# Altium schematic sheet shcematics.SchDoc: Ultra-Precision low speed ramp generator for low current calibration
size A2; PageSetup: Record=PageOptions|CenterHorizontal=True|CenterVertical=True|PrintScale=0.52|XCorrection=1.00|YCorrection=1.00|PrintKind=0|BorderSize=5000000|LeftOffset=0|BottomOffset=0|Orientation=2|PaperLength=1000|PaperWidth=1000|Scale=100|PaperSource=7|PrintQuality=-3|MediaType=1|DitherType=10|PrintScaleMode=1|PaperKind=A4|PaperIndex=9
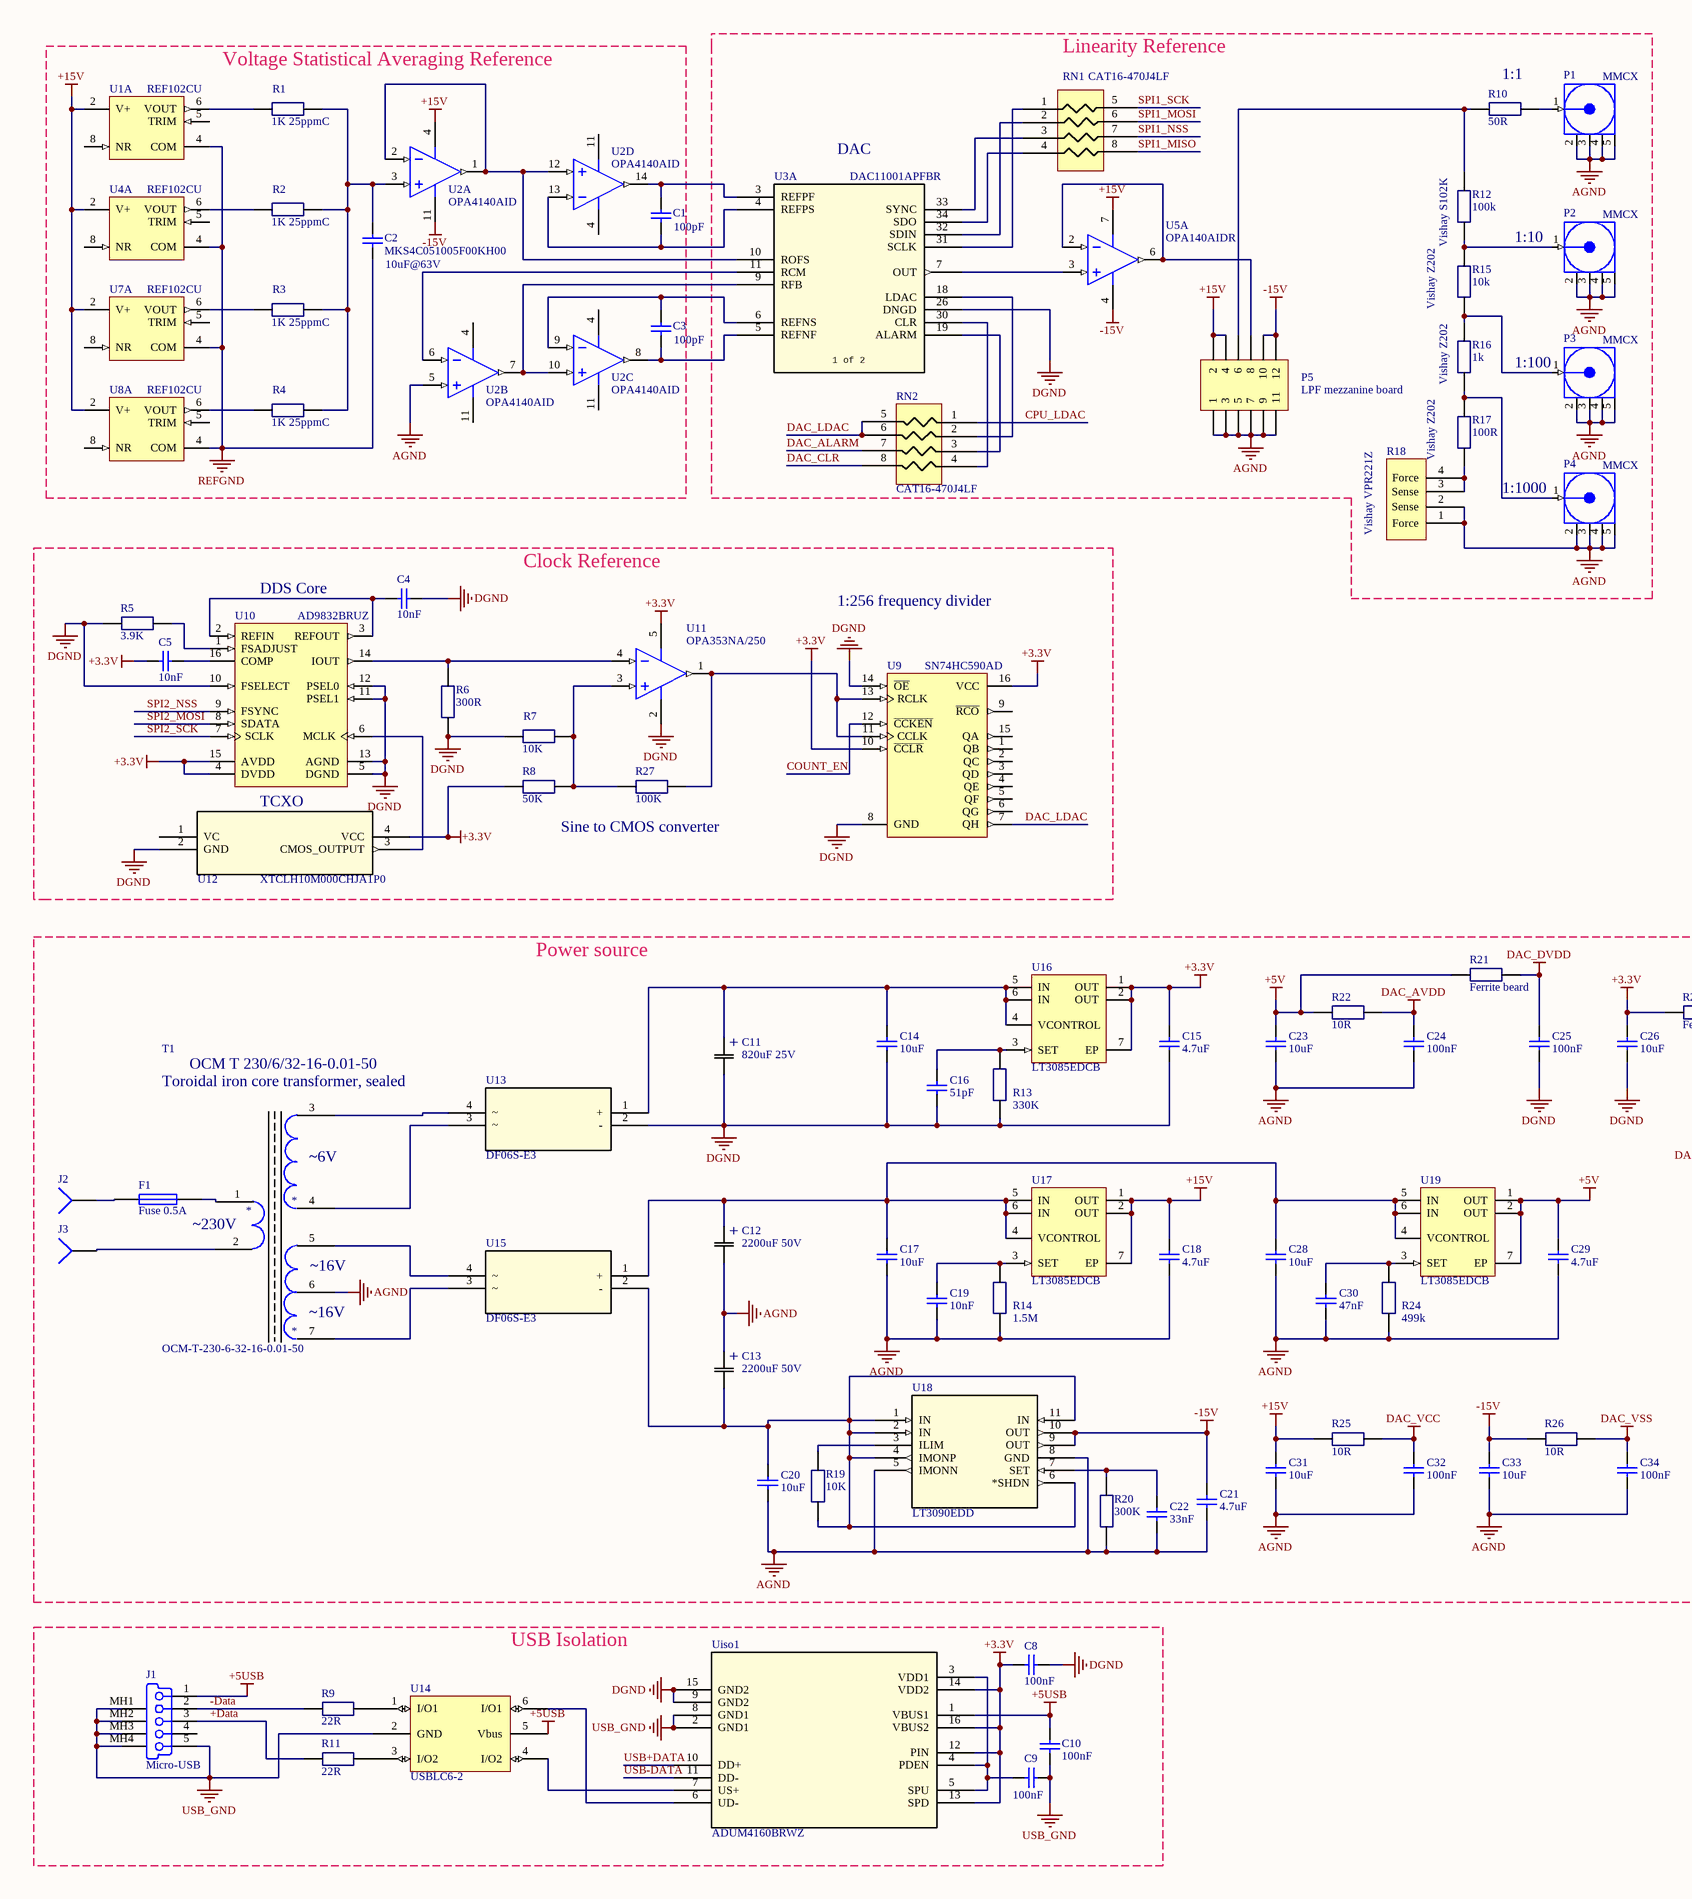
[diagram p0: shcematics.SchDoc, left]
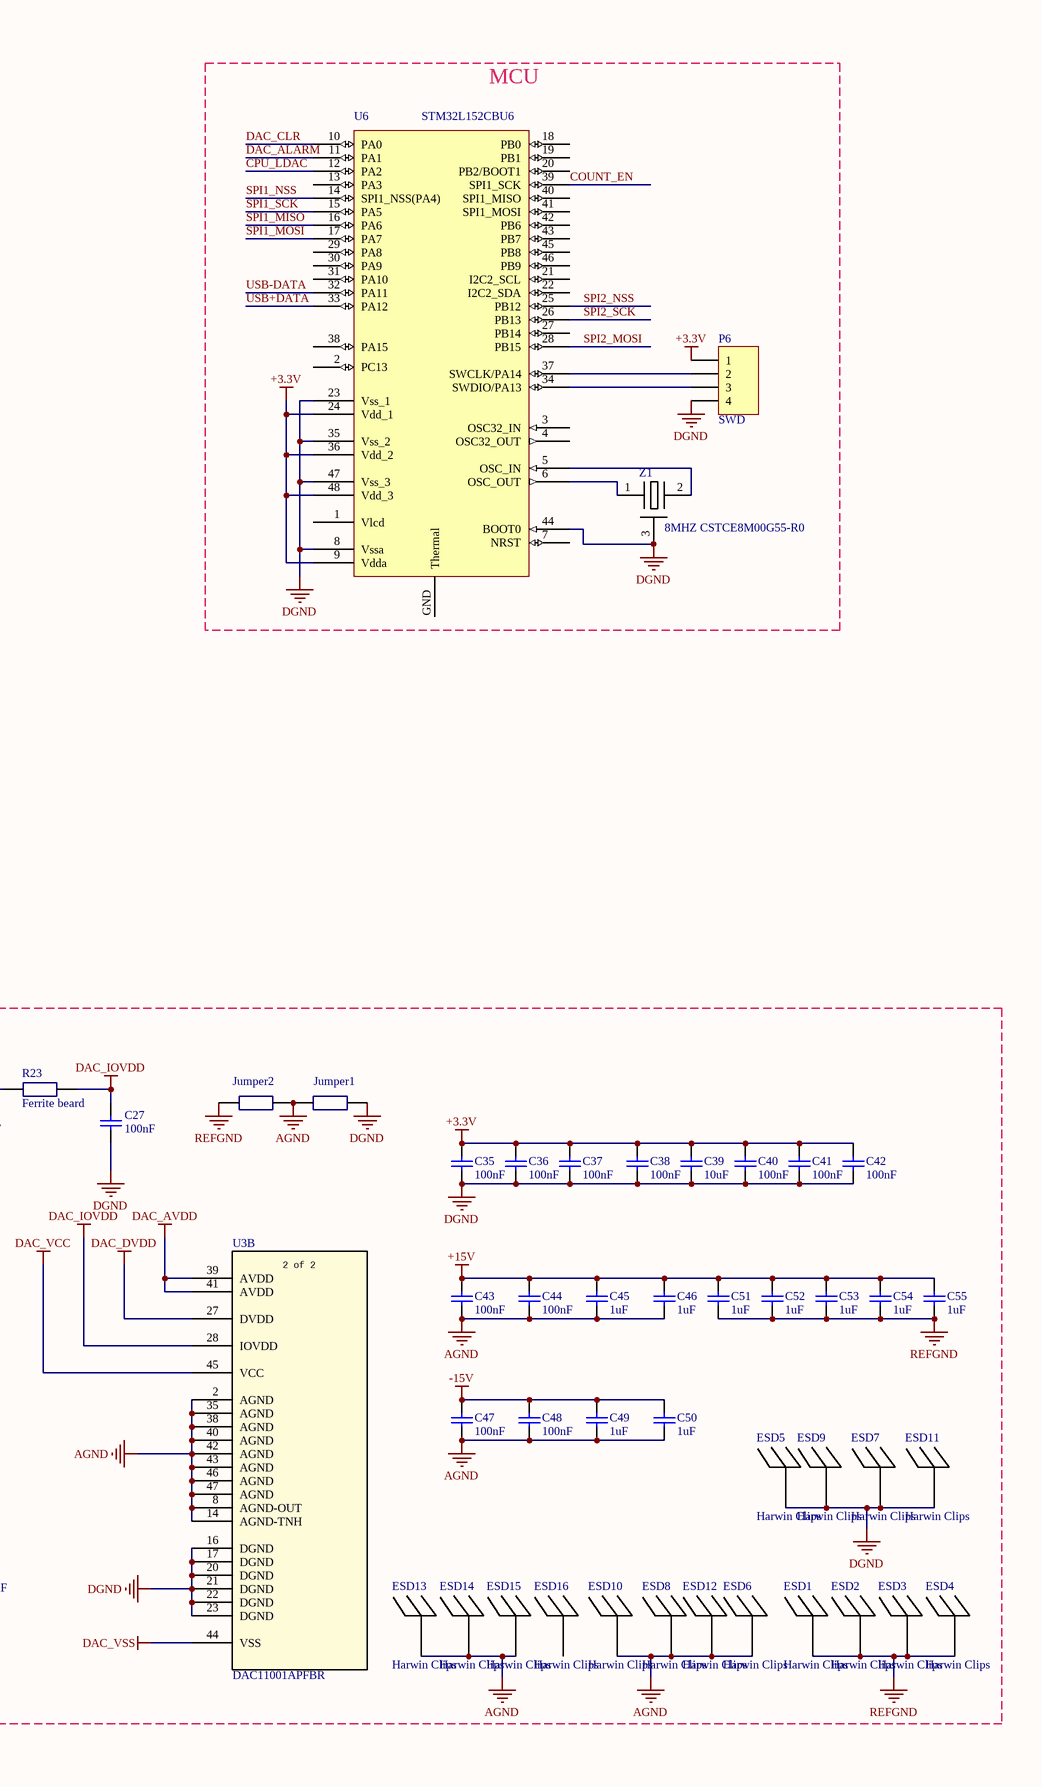
[diagram p1: shcematics.SchDoc, right]

## Parts
C1  value 100pF  [0402]  (hidden comment: Cap Semi)
C2  MKS4C051005F00KH00  value 10uF@63V  [MKS4C051005F]
C3  value 100pF  [0402]  (hidden comment: Cap Semi)
C4  10nF  [CAP 0603]
C5  10nF  [CAP 0603]
C8  100nF  [CAP 0603]
C9  100nF  [CAP 0603]
C10  100nF  [CAP 0603]
C11  820uF 25V  [CAP_37M000_TDK]
C12  2200uF 50V  [CAP_37M000_TDK]
C13  2200uF 50V  [CAP_37M000_TDK]
C14  10uF  [C1206]
C15  4.7uF  [C1206]
C16  51pF  [CAP 0603]
C17  10uF  [C1206]
C18  4.7uF  [C1206]
C19  10nF  [CAP 0603]
C20  10uF  [C1206]
C21  4.7uF  [C1206]
C22  33nF  [CAP 0603]
C23  10uF  [CAP 0603]
C24  100nF  [CAP 0603]
C25  100nF  [CAP 0603]
C26  10uF  [CAP 0603]
C27  100nF  [CAP 0603]
C28  10uF  [C1206]
C29  4.7uF  [C1206]
C30  47nF  [CAP 0603]
C31  10uF  [C1206]
C32  100nF  [CAP 0603]
C33  10uF  [C1206]
C34  100nF  [CAP 0603]
C35  100nF  [CAP 0603]
C36  100nF  [CAP 0603]
C37  100nF  [CAP 0603]
C38  100nF  [CAP 0603]
C39  10uF  [CAP 0603]
C40  100nF  [CAP 0603]
C41  100nF  [CAP 0603]
C42  100nF  [CAP 0603]
C43  100nF  [CAP 0603]
C44  100nF  [CAP 0603]
C45  1uF  [CAP 0603]
C46  1uF  [CAP 0603]
C47  100nF  [CAP 0603]
C48  100nF  [CAP 0603]
C49  1uF  [CAP 0603]
C50  1uF  [CAP 0603]
C51  1uF  [CAP 0603]
C52  1uF  [CAP 0603]
C53  1uF  [CAP 0603]
C54  1uF  [CAP 0603]
C55  1uF  [CAP 0603]
ESD1  Harwin Clips  [HARWIN - S0981-46R - CLIP]
ESD2  Harwin Clips  [HARWIN - S0981-46R - CLIP]
ESD3  Harwin Clips  [HARWIN - S0981-46R - CLIP]
ESD4  Harwin Clips  [HARWIN - S0981-46R - CLIP]
ESD5  Harwin Clips  [HARWIN - S0981-46R - CLIP]
ESD6  Harwin Clips  [HARWIN - S0981-46R - CLIP]
ESD7  Harwin Clips  [HARWIN - S0981-46R - CLIP]
ESD8  Harwin Clips  [HARWIN - S0981-46R - CLIP]
ESD9  Harwin Clips  [HARWIN - S0981-46R - CLIP]
ESD10  Harwin Clips  [HARWIN - S0981-46R - CLIP]
ESD11  Harwin Clips  [HARWIN - S0981-46R - CLIP]
ESD12  Harwin Clips  [HARWIN - S0981-46R - CLIP]
ESD13  Harwin Clips  [HARWIN - S0981-46R - CLIP]
ESD14  Harwin Clips  [HARWIN - S0981-46R - CLIP]
ESD15  Harwin Clips  [HARWIN - S0981-46R - CLIP]
ESD16  Harwin Clips  [HARWIN - S0981-46R - CLIP]
F1  Fuse 0.5A  [FUSE]
J1  Micro-USB  [10118193-0001LF]
J2  Socket  [PIN1]  (value not drawn)
J3  Socket  [PIN1]  (value not drawn)
Jumper1  (no value)  [0402 jumper]  (net tie, no BOM)
Jumper2  (no value)  [0402 jumper]  (net tie, no BOM)
P1  MMCX  [MMCX2.54-V5]
P2  MMCX  [MMCX2.54-V5]
P3  MMCX  [MMCX2.54-V5]
P4  MMCX  [MMCX2.54-V5]
P5  LPF mezzanine board  [HDR2X6]
P6  SWD  [HDR1X4]
R1  1K 25ppmC  [1608[0603]]
R2  1K 25ppmC  [1608[0603]]
R3  1K 25ppmC  [1608[0603]]
R4  1K 25ppmC  [1608[0603]]
R5  3.9K  [1608[0603]]
R6  300R  [Yegeo 0603]
R7  10K  [Yegeo 0603]
R8  50K  [Yegeo 0603]
R9  22R  [1608[0603]]
R10  50R  [1608[0603]]
R11  22R  [1608[0603]]
R12  100k  [Vishay S102K]
R13  330K  [1608[0603]]
R14  1.5M  [6-0805_M]
R15  10k  [Vishay Z202]
R16  1k  [Vishay Z202]
R17  100R  [Vishay Z202]
R18  Vishay VPR221Z  [VISHAY VPR221Z]
R19  10K  [1608[0603]]
R20  300K  [1608[0603]]
R21  Ferrite beard  [CC1206JRNPOBBN100]
R22  10R  [1608[0603]]
R23  Ferrite beard  [CC1206JRNPOBBN100]
R24  499k  [1608[0603]]
R25  10R  [1608[0603]]
R26  10R  [1608[0603]]
R27  100K  [Yegeo 0603]
RN1  CAT16-470J4LF  [CAT16-470J4LF]
RN2  CAT16-470J4LF  [CAT16-470J4LF]
T1  OCM-T-230-6-32-16-0.01-50  [OCM-T-230-6-32-16-0.01-50]
U1  REF102CU  [TI-D8_N]  (part A of 2)
U2  OPA4140AID  [TI-D14_N]  (parts A,B,C,D of 4)
U3  DAC11001APFBR  [QFP_APFBR_TEX]  (parts A,B of 2)
U4  REF102CU  [TI-D8_N]  (part A of 2)
U5  OPA140AIDR  [TI-D8_N]  (part A of 2)
U6  STM32L152CBU6  [UFQFPN48]
U7  REF102CU  [TI-D8_N]  (part A of 2)
U8  REF102CU  [TI-D8_N]  (part A of 2)
U9  SN74HC590AD  [D016_N]
U10  AD9832BRUZ  [ADI-RU-16_N]
U11  OPA353NA/250  [TI-DBV5_N]
U12  XTCLH10M000CHJA1P0  [XTCLH20M000CHJA0P0_MUR]
U13  DF06S-E3  [SO4_DFS_VIS-M]
U14  USBLC6-2  [SOT23-6L]
U15  DF06S-E3  [SO4_DFS_VIS-M]
U16  LT3085EDCB  [LT-DCB-6_V]
U17  LT3085EDCB  [LT-DCB-6_V]
U18  LT3090EDD  [DFN-10_DD]
U19  LT3085EDCB  [LT-DCB-6_V]
Uiso1  ADUM4160BRWZ  [RW_16_ADI]
Z1  8MHZ CSTCE8M00G55-R0  [PRQV8.00CR5010Y000]

## Blocks framed on the sheet
Voltage Statistical Averaging Reference: C1-C3 R1-R4 U1 U2 U4 U7 U8
Linearity Reference: P1-P5 R10 R12 R15-R18 RN1 RN2 U3 U5
MCU: P6 U6 Z1
Clock Reference: C4 C5 R5-R8 R27 U9-U12
Power source: C11-C55 ESD1-ESD16 F1 J2 J3 Jumper1 Jumper2 R13 R14 R19-R26 T1 U3 U13 U15-U19
USB Isolation: C8-C10 J1 R9 R11 U14 Uiso1

## Nets
+3.3V: C5.1 C8.2 C15.1 C26.1 C35.2 C36.2 C37.2 C38.2 C39.2 C40.2 C41.2 C42.2 P6.1 R8.2 R23.2 U6.9(Vdda) U6.24(Vdd_1) U6.36(Vdd_2) U6.48(Vdd_3) U9.10(~{CCLR}) U9.16(VCC) U10.4(DVDD) U10.15(AVDD) U11.5(V+) U12.4(VCC) U16.1(OUT) U16.2(OUT) U16.7(EP) Uiso1.12(PIN) Uiso1.13(SPD) Uiso1.14(VDD2) Uiso1.16(VBUS2)
+5USB: C10.2 J1.1(V_BUS_(5V)) U14.5(Vbus) Uiso1.1(VBUS1)
+5V: C23.1 C29.1 R21.2 R22.2 U19.1(OUT) U19.2(OUT) U19.7(EP)
+15V: C18.1 C31.1 C43.2 C44.2 C45.2 C46.2 C51.2 C52.2 C53.2 C54.2 C55.2 P5.2 P5.4 R25.2 U1.2(V+) U2.4(V+) U4.2(V+) U5.7(V+) U7.2(V+) U8.2(V+) U17.1(OUT) U17.2(OUT) U17.7(EP)
-15V: C21.1 C33.1 C47.2 C48.2 C49.2 C50.2 P5.10 P5.12 R26.2 U2.11(V-) U5.4(V-) U18.9(OUT) U18.10(OUT)
AGND: C12.2 C13.1 C17.2 C18.2 C19.2 C20.2 C21.2 C22.2 C23.2 C24.2 C28.2 C29.2 C30.2 C31.2 C32.2 C33.2 C34.2 C43.1 C44.1 C45.1 C46.1 C47.1 C48.1 C49.1 C50.1 ESD6.1 ESD8.1 ESD10.1 ESD12.1 ESD13.1 ESD14.1 ESD15.1 Jumper1.2 Jumper2.2 P1.2(GND) P1.3(GND) P1.4(GND) P1.5(GND) P2.2(GND) P2.3(GND) P2.4(GND) P2.5(GND) P3.2(GND) P3.3(GND) P3.4(GND) P3.5(GND) P4.2(GND) P4.3(GND) P4.4(GND) P4.5(GND) P5.1 P5.3 P5.5 P5.7 P5.9 P5.11 R14.2 R18.1(Force) R18.2(Sense) R20.1(A) R24.2 T1.6 U2.5(IN_B+) U3.2(AGND) U3.8(AGND-OUT) U3.14(AGND-TNH) U3.35(AGND) U3.38(AGND) U3.40(AGND) U3.42(AGND) U3.43(AGND) U3.46(AGND) U3.47(AGND) U18.5(IMONN) U18.8(GND)
DAC_AVDD: C24.1 R22.1(A) U3.39(AVDD) U3.41(AVDD)
DAC_DVDD: C25.1 R21.1(A) U3.27(DVDD)
DAC_IOVDD: C27.1 R23.1(A) U3.28(IOVDD)
DAC_VCC: C32.1 R25.1(A) U3.45(VCC)
DAC_VSS: C34.1 R26.1(A) U3.44(VSS)
DGND: C4.2 C8.1 C11.2 C14.2 C15.2 C16.2 C25.2 C26.2 C27.2 C35.1 C36.1 C37.1 C38.1 C39.1 C40.1 C41.1 C42.1 ESD5.1 ESD7.1 ESD9.1 ESD11.1 Jumper1.1(A) P6.4 R5.2 R6.1(A) R7.2 R13.2 U3.16(DGND) U3.17(DGND) U3.20(DGND) U3.21(DGND) U3.22(DGND) U3.23(DGND) U3.26(DNGD) U6.8(Vssa) U6.23(Vss_1) U6.35(Vss_2) U6.44(BOOT0) U6.47(Vss_3) U9.8(GND) U9.14(~{OE}) U10.5(DGND) U10.10(FSELECT) U10.11(PSEL1) U10.12(PSEL0) U10.13(AGND) U11.2(V-) U12.2(GND) U13.2(-) Uiso1.9(GND2) Uiso1.15(GND2) Z1.3
REFGND: C2.1 C51.1 C52.1 C53.1 C54.1 C55.1 ESD1.1 ESD2.1 ESD3.1 ESD4.1 Jumper2.1(A) U1.4(COM) U4.4(COM) U7.4(COM) U8.4(COM)
USB_GND: C9.1 C10.1 J1.5(GND) J1.MH1(Tab) J1.MH2(Tab) J1.MH3(Tab) J1.MH4(Tab) U14.2(GND) Uiso1.2(GND1) Uiso1.8(GND1)
+Data: J1.3(D+) R11.2
-Data: J1.2(D-) R9.2
COUNT_EN: U6.39(SPI1_SCK) U9.12(~{CCKEN})
CPU_LDAC: RN2.1 U6.12(PA2)
DAC_ALARM: RN2.7 U6.11(PA1)
DAC_CLR: RN2.8 U6.10(PA0)
DAC_LDAC: RN2.5 RN2.6 U9.7(QH)
SPI1_MISO: RN1.8 U6.16(PA6)
SPI1_MOSI: RN1.6 U6.17(PA7)
SPI1_NSS: RN1.7 U6.14(SPI1_NSS(PA4))
SPI1_SCK: RN1.5 U6.15(PA5)
SPI2_MOSI: U6.28(PB15) U10.8(SDATA)
SPI2_NSS: U6.25(PB12) U10.9(FSYNC)
SPI2_SCK: U6.26(PB13) U10.7(SCLK)
USB+DATA: U6.33(PA12) Uiso1.10(DD+)
USB-DATA: U6.32(PA11) Uiso1.11(DD-)
NetC1_1: C1.1 U2.13(IN_D-) U3.4(REFPS)
NetC1_2: C1.2 U2.14(OUT_D) U3.3(REFPF)
NetC2_2: C2.2 R1.1(A) R2.1(A) R3.1(A) R4.1(A) U2.3(IN_A+)
NetC3_1: C3.1 U2.8(OUT_C) U3.5(REFNF)
NetC3_2: C3.2 U2.9(IN_C-) U3.6(REFNS)
NetC4_1: C4.1 U10.2(REFIN) U10.3(REFOUT)
NetC5_2: C5.2 U10.16(COMP)
NetC9_2: C9.2 Uiso1.3(VDD1) Uiso1.4(PDEN) Uiso1.5(SPU)
NetC11_1: C11.1 C14.1 U13.1(+) U16.4(VCONTROL) U16.5(IN) U16.6(IN)
NetC12_1: C12.1 C17.1 C28.1 U15.1(+) U17.4(VCONTROL) U17.5(IN) U17.6(IN) U19.4(VCONTROL) U19.5(IN) U19.6(IN)
NetC13_2: C13.2 C20.1 R19.1(A) U15.2(-) U18.1(IN) U18.2(IN) U18.4(IMONP) U18.6(*SHDN) U18.11(IN)
NetC16_1: C16.1 R13.1(A) U16.3(SET)
NetC19_1: C19.1 R14.1(A) U17.3(SET)
NetC22_1: C22.1 R20.2 U18.7(SET)
NetC30_1: C30.1 R24.1(A) U19.3(SET)
NetF1_1: F1.1 J2.1
NetF1_2: F1.2 T1.1
NetJ3_1: J3.1 T1.2
NetP1_1: P1.1(Signal) R10.1(A)
NetP2_1: P2.1(Signal) R12.2 R15.1(A)
NetP3_1: P3.1(Signal) R15.2 R16.1(A)
NetP4_1: P4.1(Signal) R16.2 R17.1(A)
NetP5_6: P5.6 R10.2 R12.1(A)
NetP5_8: P5.8 U5.2(IN-) U5.6(OUT)
NetP6_2: P6.2 U6.37(SWCLK/PA14)
NetP6_3: P6.3 U6.34(SWDIO/PA13)
NetR1_2: R1.2 U1.6(VOUT)
NetR2_2: R2.2 U4.6(VOUT)
NetR3_2: R3.2 U7.6(VOUT)
NetR4_2: R4.2 U8.6(VOUT)
NetR5_1: R5.1(A) U10.1(FSADJUST)
NetR6_2: R6.2 U10.14(IOUT) U11.4(IN-)
NetR7_1: R7.1(A) R8.1(A) R27.2 U11.3(IN+)
NetR9_1: R9.1(A) U14.1(I/O1)
NetR11_1: R11.1(A) U14.3(I/O2)
NetR17_2: R17.2 R18.3(Sense) R18.4(Force)
NetR19_2: R19.2 U18.3(ILIM)
NetR27_1: R27.1(A) U9.11(CCLK) U9.13(RCLK) U11.1(OUT)
NetRN1_1: RN1.1 U3.31(SCLK)
NetRN1_2: RN1.2 U3.32(SDIN)
NetRN1_3: RN1.3 U3.33(SYNC)
NetRN1_4: RN1.4 U3.34(SDO)
NetRN2_2: RN2.2 U3.18(LDAC)
NetRN2_3: RN2.3 U3.19(ALARM)
NetRN2_4: RN2.4 U3.30(CLR)
NetT1_3: T1.3 U13.4
NetT1_4: T1.4 U13.3
NetT1_5: T1.5 U15.4
NetT1_7: T1.7 U15.3
NetU2_1: U2.1(OUT_A) U2.2(IN_A-) U2.12(IN_D+) U3.10(ROFS)
NetU2_6: U2.6(IN_B-) U3.11(RCM)
NetU2_7: U2.7(OUT_B) U2.10(IN_C+) U3.9(RFB)
NetU3_7: U3.7(OUT) U5.3(IN+)
NetU6_5: U6.5(OSC_IN) Z1.2
NetU6_6: U6.6(OSC_OUT) Z1.1
NetU10_6: U10.6(MCLK) U12.3(CMOS_OUTPUT)
NetU14_4: U14.4(I/O2) Uiso1.7(US+)
NetU14_6: U14.6(I/O1) Uiso1.6(UD-)

Not connected (* = marked no-connect by the designer): ESD16 1; J1 4(NC); U1 5(TRIM) 8(NR); U4 5(TRIM) 8(NR); U6 1(Vlcd) 2(PC13) 3(OSC32_IN) 4(OSC32_OUT) 7(NRST) 13(PA3) 18(PB0) 19(PB1) 20(PB2/BOOT1) 21(I2C2_SCL) 22(I2C2_SDA) 27(PB14) 29(PA8) 30(PA9) 31(PA10) 38(PA15) 40(SPI1_MISO) 41(SPI1_MOSI) 42(PB6) 43(PB7) 45(PB8) 46(PB9) GND(Thermal); U7 5(TRIM) 8(NR); U8 5(TRIM) 8(NR); U9 1(QB) 2(QC) 3(QD) 4(QE) 5(QF) 6(QG) 9(~{RCO}) 15(QA); U12 1(VC)

## Notes on the sheet
- (near R10) 1:1
- (near U3) DAC
- (near P2) 1:10
- (near P3) 1:100
- (near P4) 1:1000
- (near U10) DDS Core
- 1:256 frequency divider
- TCXO
- Sine to CMOS converter
- (in symbol B41858D9337M000) +
- (in symbol DAC11001APFBR, part A) 1 of 2
- (in symbol DAC11001APFBR, part B) 2 of 2
- (in symbol OCM-T-230-6-32-16-0.01-50) OCM T 230/6/32-16-0.01-50; Toroidal iron core transformer, sealed; ~6V; ~230V; ~16V

## Library data of the parts
C1 C3 = Cap Semi: Capacitor (Semiconductor SIM Model); Published: 8-Jun-2000; LatestRevisionDate: 29-May-2009; LatestRevisionNote: IPC-7351 Footprint Added.; PackageReference: C1206; Publisher: Altium Limited; PackageDescription: Chip Capacitor
C2 = Cap: Capacitor; Published: 8-Jun-2000; LatestRevisionDate: 17-Jul-2002; LatestRevisionNote: Re-released for DXP Platform.; PackageReference: RAD-0.3; Publisher: Altium Limited; PackageDescription: Radial Cap, Thru-Hole; 2 Leads; 0.3 in Pin Spacing; Oredr: MKS4C051005F00KH00
C4 C5 C8-C10 C16 C19 C22-C27 C30-C55 = Cap Semi: Capacitor (Semiconductor SIM Model); Order: CC0603KRX7R8BB104; Published: 8-Jun-2000; LatestRevisionDate: 29-May-2009; LatestRevisionNote: IPC-7351 Footprint Added.; PackageReference: C1206; Publisher: Altium Limited; PackageDescription: Chip Capacitor
  C4 C5 C19: Value: 10nF
  C8-C10 C24 C25 C27 C32 C34-C38 C40-C44 C47 C48: Value: 100nF
  C16: Value: 51pF
  C22: Value: 33nF
  C23 C26 C31 C33 C39: Value: 10uF
  C30: Value: 47nF
  C45 C46 C49-C55: Value: 1uF
C11-C13 = B41858D9337M000: No Description Available; Vendor: TDK; Built_By: EMA_Matt; SourceLibrary: Add_to_database_2021-01-04; Type: DEV; Datasheet: https://product.tdk.com/info/en/documents/data_sheet/20/30/db/aec/B41858.pdf; Copyright: Copyright (C) 2018 Accelerated Designs. All rights reserved; Manufacturer_Part_Number: B41858D9337M000; RefDes: RefDes
C14 C17 C28 = Cap Semi: Capacitor (Semiconductor SIM Model); Order: GRM31CR61A476ME15L; Published: 8-Jun-2000; LatestRevisionDate: 29-May-2009; LatestRevisionNote: IPC-7351 Footprint Added.; PackageReference: C1206; Publisher: Altium Limited; PackageDescription: Chip Capacitor; Value: 10uF
C15 C18 C20 C21 C29 = Cap Semi: Capacitor (Semiconductor SIM Model); Order: GRM31CR71A475KA01L; Published: 8-Jun-2000; LatestRevisionDate: 29-May-2009; LatestRevisionNote: IPC-7351 Footprint Added.; PackageReference: C1206; Publisher: Altium Limited; PackageDescription: Chip Capacitor
  C15 C18 C21 C29: Value: 4.7uF
  C20: Value: 10uF
ESD1-ESD16 = Harwin Clips: Order: S0981-46R
F1 = Fuse 1: Fuse; Published: 8-Jun-2000; LatestRevisionDate: 17-Jul-2002; LatestRevisionNote: Re-released for DXP Platform.; PackageReference: PIN-W2/E2.8; Publisher: Altium Limited; PackageDescription: Thru-Hole; 2 Leads
J1 = 0481900001: USB On-The-Go (OTG) Mini-B Receptacle, Right Angle, SMT, 0.80mm (.031") Pitch, Solder Tabs with Back Cover, Recessed Type; Order: Molex 47346-0001
Jumper1 Jumper2 R12 R15-R17 = Resistor 0805: Avail: 20
  R12: Order: Vishay S102K; Value: 100k
  R15: Order: Vishay Z202; Value: 10k
  R16: Order: Vishay Z202; Value: 1k
  R17: Order: Vishay Z202; Value: 100R
P1-P4 = COAX-M: RF Coaxial PCB Connector, MMCX; Thru-Hole, Vertical Mount Plug,  50 Ohm Impedance; PackageDocument: Rev. A, 16-Jun-1997; PCB_Layout: Complies with manufacturer's recommendation.; DrillSize: Corresponds to nominal value.; Published: 15-Jul-2004; LatestRevisionDate: 15-Jul-2004; LatestRevisionNote: Component Replaced.; DatasheetDocument: 30-May-2003; PackageReference: 908-21103; Publisher: Altium Limited; ComponentLink1Description: Manufacturer Link; ComponentLink1URL: http://www.amphenolrf.com/
P5 = Header 6X2: Header, 6-Pin, Dual row; LatestRevisionDate: 17-Jul-2002; LatestRevisionNote: Re-released for DXP Platform.; Publisher: Altium Limited
P6 = Header 4: Header, 4-Pin; LatestRevisionDate: 17-Jul-2002; LatestRevisionNote: Re-released for DXP Platform.; Publisher: Altium Limited
R1-R8 R10 R27 = Resistor 0805: Order: ERA-3AEB49R9V; Avail: 20
  R1-R4: Value: 1K 25ppmC
  R5: Value: 3.9K
  R6: Value: 300R
  R7: Value: 10K
  R8: Value: 50K
  R10: Value: 50R
  R27: Value: 100K
R9 R11 = Resistor 0805: Order: CR0603-JW-220GLF; Avail: 20; Value: 22R
R13 R14 R24 = Resistor 0805: Order: ERA-3AEB2493V; Avail: 20
  R13: Value: 330K
  R14: Value: 1.5M
  R24: Value: 499k
R19 = Resistor 0805: Order: ERA-3AEB103V; Avail: 20; Value: 10K
R20-R23 R25 R26 = Resistor 0805: Order: ERA-3AEB4992V; Avail: 20
  R20: Value: 300K
  R21 R23: Value: Ferrite beard
  R22 R25 R26: Value: 10R
U1 U4 U7 U8 = REF102CU: 10 V Precision Voltage Reference, -25 to 85 degC, 8-pin SOIC (D), Green (RoHS & no Sb/Br); Manufacturer: Texas Instruments; Initial Accuracy @ 25/deg C(%): 0.05; Iout/Iz(Max)(mA): 10; Iq(Max)(uA): 1400; Rating: Catalog; SubFamily: Series Voltage Reference; Temp Coeff(Max)(ppm/ degree C): 5; VI(Max)(V): 36; VI(Min)(V): 11.4; DatasheetVersion: SBVS022B; PackageVersion: 4040047-3/M; PackageReference: D8; PackageDescription: 8-Pin Plastic Small Outline, Body 4.9 x 3.9 mm, Pitch 1.27 mm; Supplier 1: Digi-Key; Supplier Part Number 1: 296-17006-5-ND; Supplier 2: Newark; Supplier Part Number 2: 90H3365; Supplier 3: Mouser; Supplier Part Number 3: 595-REF102CU; Eco-Plan: Green (RoHS & no Sb/Br); VO(V): 10; Mounting Technology: Surface Mount; Code_JEDEC: MS-012; PartNumber: REF102CU; ComponentLink1Description: Manufacturer URL; ComponentLink1URL: http://www.ti.com/; ComponentLink2Description: Datasheet; ComponentLink2URL: http://www.ti.com/general/docs/lit/getliterature.tsp?genericPartNumber=REF102&fileType=pdf; ComponentLink3Description: Package Specification; ComponentLink3URL: http://www.ti.com/litv/pdf/msoi002j
U2 = OPA4140AID: 11 MHz, Single Supply, Low Noise, Precision, Rail-to-Rail Output, JFET Amplifier, 4.5 to 36 V, -40 to 125 degC, 14-pin SOIC (D14), Green (RoHS & no Sb/Br); Manufacturer: Texas Instruments; CMRR(Min)(dB): 126; GBW(Typ)(MHz): 11; IIB(Max)(pA): 10; Iq per channel(Max)(mA): 2; Number of Channels: 4; Offset Drift(Typ)(uV/C): 0.35; Packing: TUBE; Rating: Catalog; Slew Rate(Typ)(V/us): 20; Sub Family: High Supply Voltage Amplifier (>=30V), Low Input Bias Current Amp (<=10pA), Low Noise Amp (<=10nV/rtHz), Low Offset Voltage Amplifier (<=500uV), Precision Amplifier; Total Supply Voltage(Max)(+5V is 5, +/-5V is 10): 36; Total Supply Voltage(Min)(+5V is 5, +/-5V is 10): 4.5; Vio (25C)(Max)(mV): 0.12; DatasheetVersion: SBOS498A; PackageVersion: 4040047-5/M, 06/2011; PackageReference: D14; PackageDescription: 14-Pin Plastic Small Outline, Body 8.65 x 3.9 mm, Pitch 1.27 mm; Supplier 1: Digi-Key; Supplier Part Number 1: 296-28130-ND; Supplier 2: Farnell; Supplier Part Number 2: 1863107; Supplier 3: Newark; Supplier Part Number 3: 25T0266; Supplier 4: Mouser; Supplier Part Number 4: 595-OPA4140AID; Eco-Plan: Green (RoHS & no Sb/Br); Mounting Technology: Surface Mount; Code_JEDEC: MS-012; PartNumber: OPA4140AID; ComponentLink1Description: Manufacturer URL; ComponentLink1URL: http://www.ti.com/; ComponentLink2Description: Datasheet; ComponentLink2URL: http://www.ti.com/lit/ds/symlink/opa4140.pdf; ComponentLink3Description: Package Specification; ComponentLink3URL: http://www.ti.com/lit/ml/mpds177g/mpds177g.pdf
U3 = DAC11001APFBR: No Description Available; Vendor: Texas Instruments; Built_By: EMA_Matt; SourceLibrary: Texas_Instruments_2020-07-20; Manufacturer_Part_Number: DAC11001APFBR; Copyright: Copyright (C) 2018 Accelerated Designs. All rights reserved; Datasheet: https://www.ti.com/lit/ds/symlink/dac11001a.pdf; RefDes: RefDes; Type: DEV
U5 = OPA140AIDR: 11 MHz, Single Supply, Low Noise, Precision, Rail-to-Rail Output, JFET Amplifier, 4.5 to 36 V, -40 to 125 degC, 8-pin SOIC (D8), Green (RoHS & no Sb/Br); Manufacturer: Texas Instruments; CMRR(Min)(dB): 126; GBW(Typ)(MHz): 11; IIB(Max)(pA): 10; Iq per channel(Max)(mA): 2; Number of Channels: 1; Offset Drift(Typ)(uV/C): 0.35; Packing: LARGE T&R; Rating: Catalog; Slew Rate(Typ)(V/us): 20; Sub Family: High Supply Voltage Amplifier (>=30V), Low Input Bias Current Amp (<=10pA), Low Noise Amp (<=10nV/rtHz), Low Offset Voltage Amplifier (<=500uV), Precision Amplifier; Total Supply Voltage(Max)(+5V is 5, +/-5V is 10): 36; Total Supply Voltage(Min)(+5V is 5, +/-5V is 10): 4.5; Vio (25C)(Max)(mV): 0.12; DatasheetVersion: SBOS498A; PackageVersion: 4040047-3/M, 06/2011; PackageReference: D8; PackageDescription: 8-Pin Plastic Small Outline, Body 4.9 x 3.9 mm, Pitch 1.27 mm; Supplier 1: Digi-Key; Supplier Part Number 1: OPA140AIDR-ND; Supplier 2: Newark; Supplier Part Number 2: 21T3836; Supplier 3: Mouser; Supplier Part Number 3: 595-OPA140AIDR; Eco-Plan: Green (RoHS & no Sb/Br); Mounting Technology: Surface Mount; Code_JEDEC: MS-012; PartNumber: OPA140AIDR; ComponentLink1Description: Manufacturer URL; ComponentLink1URL: http://www.ti.com/; ComponentLink2Description: Datasheet; ComponentLink2URL: http://www.ti.com/lit/ds/symlink/opa140.pdf; ComponentLink3Description: Package Specification; ComponentLink3URL: http://www.ti.com/litv/pdf/msoi002j
U9 = SN74HC590AD: 8-Bit Binary Counter with 3-State Output Registers; Published: 8-Jun-2000; LatestRevisionDate: 13-Apr-2006; LatestRevisionNote: IPC-7351 Footprint Added.; DatasheetVersion: May-1997; PackageVersion: Jan-1998; PackageReference: D016; Publisher: Altium Limited; PackageDescription: 16-Pin Small Outline Integrated Circuit 1.27 mm Pitch; Code_IPC: SOIC127P600-16; ComponentLink1Description: Manufacturer Link; ComponentLink1URL: http://www.ti.com/; ComponentLink2Description: Datasheet; ComponentLink2URL: http://www-s.ti.com/sc/ds/sn74hc590a.pdf
U10 = AD9832BRUZ: 25 MHz Direct Digital Synthesizer, Waveform Generator, 10-Bit, Serial, RU-16, 96 Tube, Pb-Free; Master fclk: 25MHz; Resolution (Bits): 10bit; Tuning Word Width (bits): 32bit; REFCLK Multiplier: No; Compliance Range (V): 1.35V; FS Iout (mA nom): 4mA; I Supply total (max): 15mA; DatasheetVersion: Rev. C; PackageVersion: Nov-2002; PackageReference: RU-16; PackageDescription: 16-Lead Thin Shrink Small Outline Package [TSSOP]; I/O Interface: Serial; Code_JEDEC: MO-153AB; ComponentLink1Description: Manufacturer URL; ComponentLink1URL: www.analog.com; ComponentLink2Description: Datasheet; ComponentLink2URL: http://www.analog.com/static/imported-files/data_sheets/AD9832.pdf; ComponentLink3Description: Package Specification; ComponentLink3URL: http://www.analog.com/static/imported-files/packages/36244347913743854010197452789RU16.pdf
U11 = OPA353NA/250: High-Speed, Single-Supply, Rail-to-Rail Operational Amplifier MicroAmplifier(TM) Series, 2.7 to 5.5 V, -40 to 85 degC, 5-pin SOT23 (DBV5), Green (RoHS & no Sb/Br); Manufacturer: Texas Instruments; CMRR(Min)(dB): 76; GBW(Typ)(MHz): 44; IIB(Max)(pA): 10; Iq per channel(Max)(mA): 8; Number of Channels: 1; Offset Drift(Typ)(uV/C): 5; Packing: SMALL T&R; Rating: Catalog; Slew Rate(Typ)(V/us): 22; Sub Family: High Output Current Amplifier (>=50mA), Low Input Bias Current Amp (<=10pA), Low Supply Voltage Amplifier (<=2.7V), Precision Amplifier; Total Supply Voltage(Max)(+5V is 5, +/-5V is 10): 5.5; Total Supply Voltage(Min)(+5V is 5, +/-5V is 10): 2.7; DatasheetVersion: SBOS103; PackageVersion: 4073253-4/K, 03/2006; PackageReference: DBV5; PackageDescription: 5-Pin Plastic Small Outline, Body 1.6 x 2.9 mm, Pitch 0.95 mm; Supplier 1: Digi-Key; Supplier Part Number 1: OPA353NATR-ND; Supplier 2: Digi-Key; Supplier Part Number 2: OPA353NACT-ND; Supplier 3: Digi-Key; Supplier Part Number 3: OPA353NADKR-ND; Supplier 4: Farnell; Supplier Part Number 4: 1207049; Supplier 5: Farnell; Supplier Part Number 5: 1207049RL; Supplier 6: Newark; Supplier Part Number 6: 35C1895; Supplier 7: Mouser; Supplier Part Number 7: 595-OPA353NA/250; Eco-Plan: Green (RoHS & no Sb/Br); Vio (25C)(Max)(mV): 8; Mounting Technology: Surface Mount; Code_JEDEC: MO-178; PartNumber: OPA353NA/250; ComponentLink1Description: Manufacturer URL; ComponentLink1URL: http://www.ti.com/; ComponentLink2Description: Datasheet; ComponentLink2URL: http://www.ti.com/lit/ds/symlink/opa353.pdf; ComponentLink3Description: Package Specification; ComponentLink3URL: http://www.ti.com/litv/pdf/mpds018i
U12 = XTCLH20M000CHJA0P0: No Description Available; Vendor: Murata; Built_By: EMA_Cory; SourceLibrary: Murata_2020-04-02; Datasheet: https://www.murata.com/en/products/productdata/8801053966366/SPEC-XTCLH20M000CHJA0P0.pdf; Manufacturer_Part_Number: XTCLH20M000CHJA0P0; Copyright: Copyright (C) 2018 Accelerated Designs. All rights reserved; RefDes: RefDes; Type: DEV
U13 U15 = DF06S-E3: No Description Available; Vendor: Vishay; Built_By: EMA_UL_Team; SourceLibrary: Vishay_2020-02-10; Manufacturer_Part_Number: DF06S-E3; Copyright: Copyright (C) 2018 Accelerated Designs. All rights reserved; RefDes: RefDes; Type: DEV
U14 = USBLC6-2: Avail: 1; Order: USBLC6-2
U16 U17 U19 = LT3085EDCB#PBF: Adjustable 500 mA Single Resistor Low Dropout Regulator, 0.3 mA Isupply, 6-pin SON (DCB-6), -40 to 125 degC, Pb-Free; Manufacturer: Linear Technology; Extended Temp: E, I, MP; Initial Accuracy(%): 1; Isupply(mA): 0.3; Vin Max(V): 36; Vin Min(V): 1.2; DatasheetVersion: Rev. B; PackageVersion: Rev. A, 03/2011; PackageReference: DCB-6; PackageDescription: 6-Pin Plastic DFN, Body 2 x 3 mm, Pitch 0.5 mm; Supplier 1: Farnell; Supplier Part Number 1: 2308197; Supplier 2: Newark; Supplier Part Number 2: 78T3981; RoHS: TRUE; Mounting Technology: Surface Mount; Code_JEDEC: MO-229; PartNumber: LT3085EDCB#PBF; ComponentLink1Description: Manufacturer URL; ComponentLink1URL: http://www.linear.com/; ComponentLink2Description: Datasheet; ComponentLink2URL: http://cds.linear.com/docs/en/datasheet/3085fb.pdf; ComponentLink3Description: Package Specification; ComponentLink3URL: http://www.linear.com/docs/en/packaging/(DCB6)%20DFN%2005-08-1715%20Rev%20A.pdf; Order: LT3085EDCB
U18 = LT3090EDDPBF: Imported; Manufacturer_Part_Number: lt3090edd#pbf; Vendor: Linear Technology; Value: Value; Type: Type; RefDes: RefDes; Order: LT3090EDD
Uiso1 = ADUM4160BRWZ: No Description Available; Vendor: Analog Devices Inc; Built_By: EMA_UL_Team; SourceLibrary: Analog_2015-12-15; Manufacturer_Part_Number: ADUM4160BRWZ; Copyright: Copyright (C) 2018 Accelerated Designs. All rights reserved; RefDes: RefDes; Type: DEV
Z1 = 8MHZ_cap
J2 J3 = Socket: LatestRevisionDate: 17-Jul-2002; LatestRevisionNote: Re-released for DXP Platform.; Publisher: Altium Limited